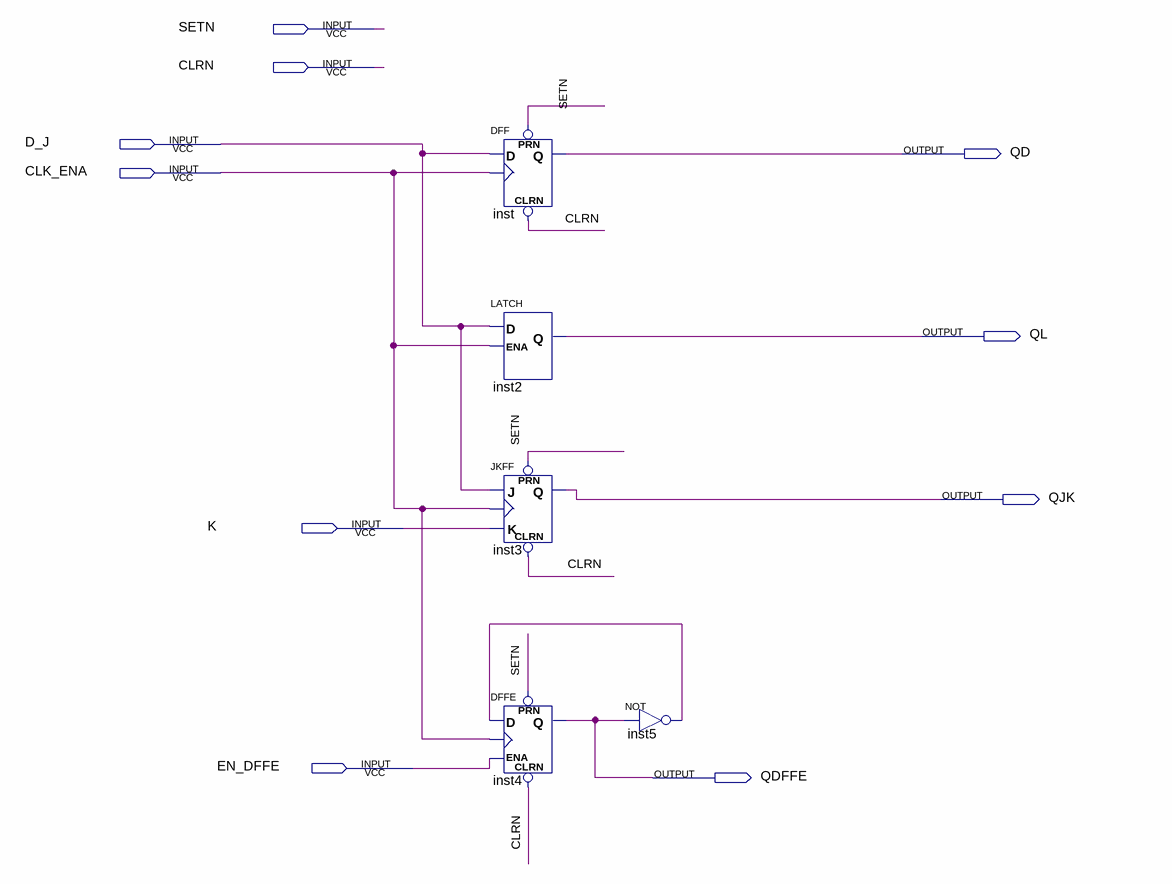
[diagram p0: schematic sheet]
// Quartus schematic lab301SUM.bdf as structural Verilog: 5 symbols, 10 pins
module lab301SUM (
  input  SETN,
  input  CLRN,
  input  D_J,
  input  CLK_ENA,
  input  K,
  input  EN_DFFE,
  output QD,
  output QL,
  output QJK,
  output QDFFE
);

  wire inst5_out;

  DFF inst (.CLRN(CLRN), .CLK(CLK_ENA), .D(D_J), .PRN(SETN), .Q(QD));
  LATCH inst2 (.D(D_J), .ENA(CLK_ENA), .Q(QL));
  JKFF inst3 (.PRN(SETN), .CLRN(CLRN), .K(K), .J(D_J), .CLK(CLK_ENA), .Q(QJK));
  DFFE inst4 (.PRN(SETN), .CLRN(CLRN), .D(inst5_out), .CLK(CLK_ENA), .ENA(EN_DFFE), .Q(QDFFE));
  not inst5 (inst5_out, QDFFE);
endmodule
